# EasyEDA Pro project ProDoc_Schematic1_2025-12-02.epro

# Schematic Schematic1
Board Name: Board1; Create Date: 2025-11-19; Page Name: P1; Project Name: BezelMountPCBforSwitches; Schematic Name: Schematic1; Update Date: 2025-12-01; Company: EasyEDA.com; Page Size: A4; Version: V1.0
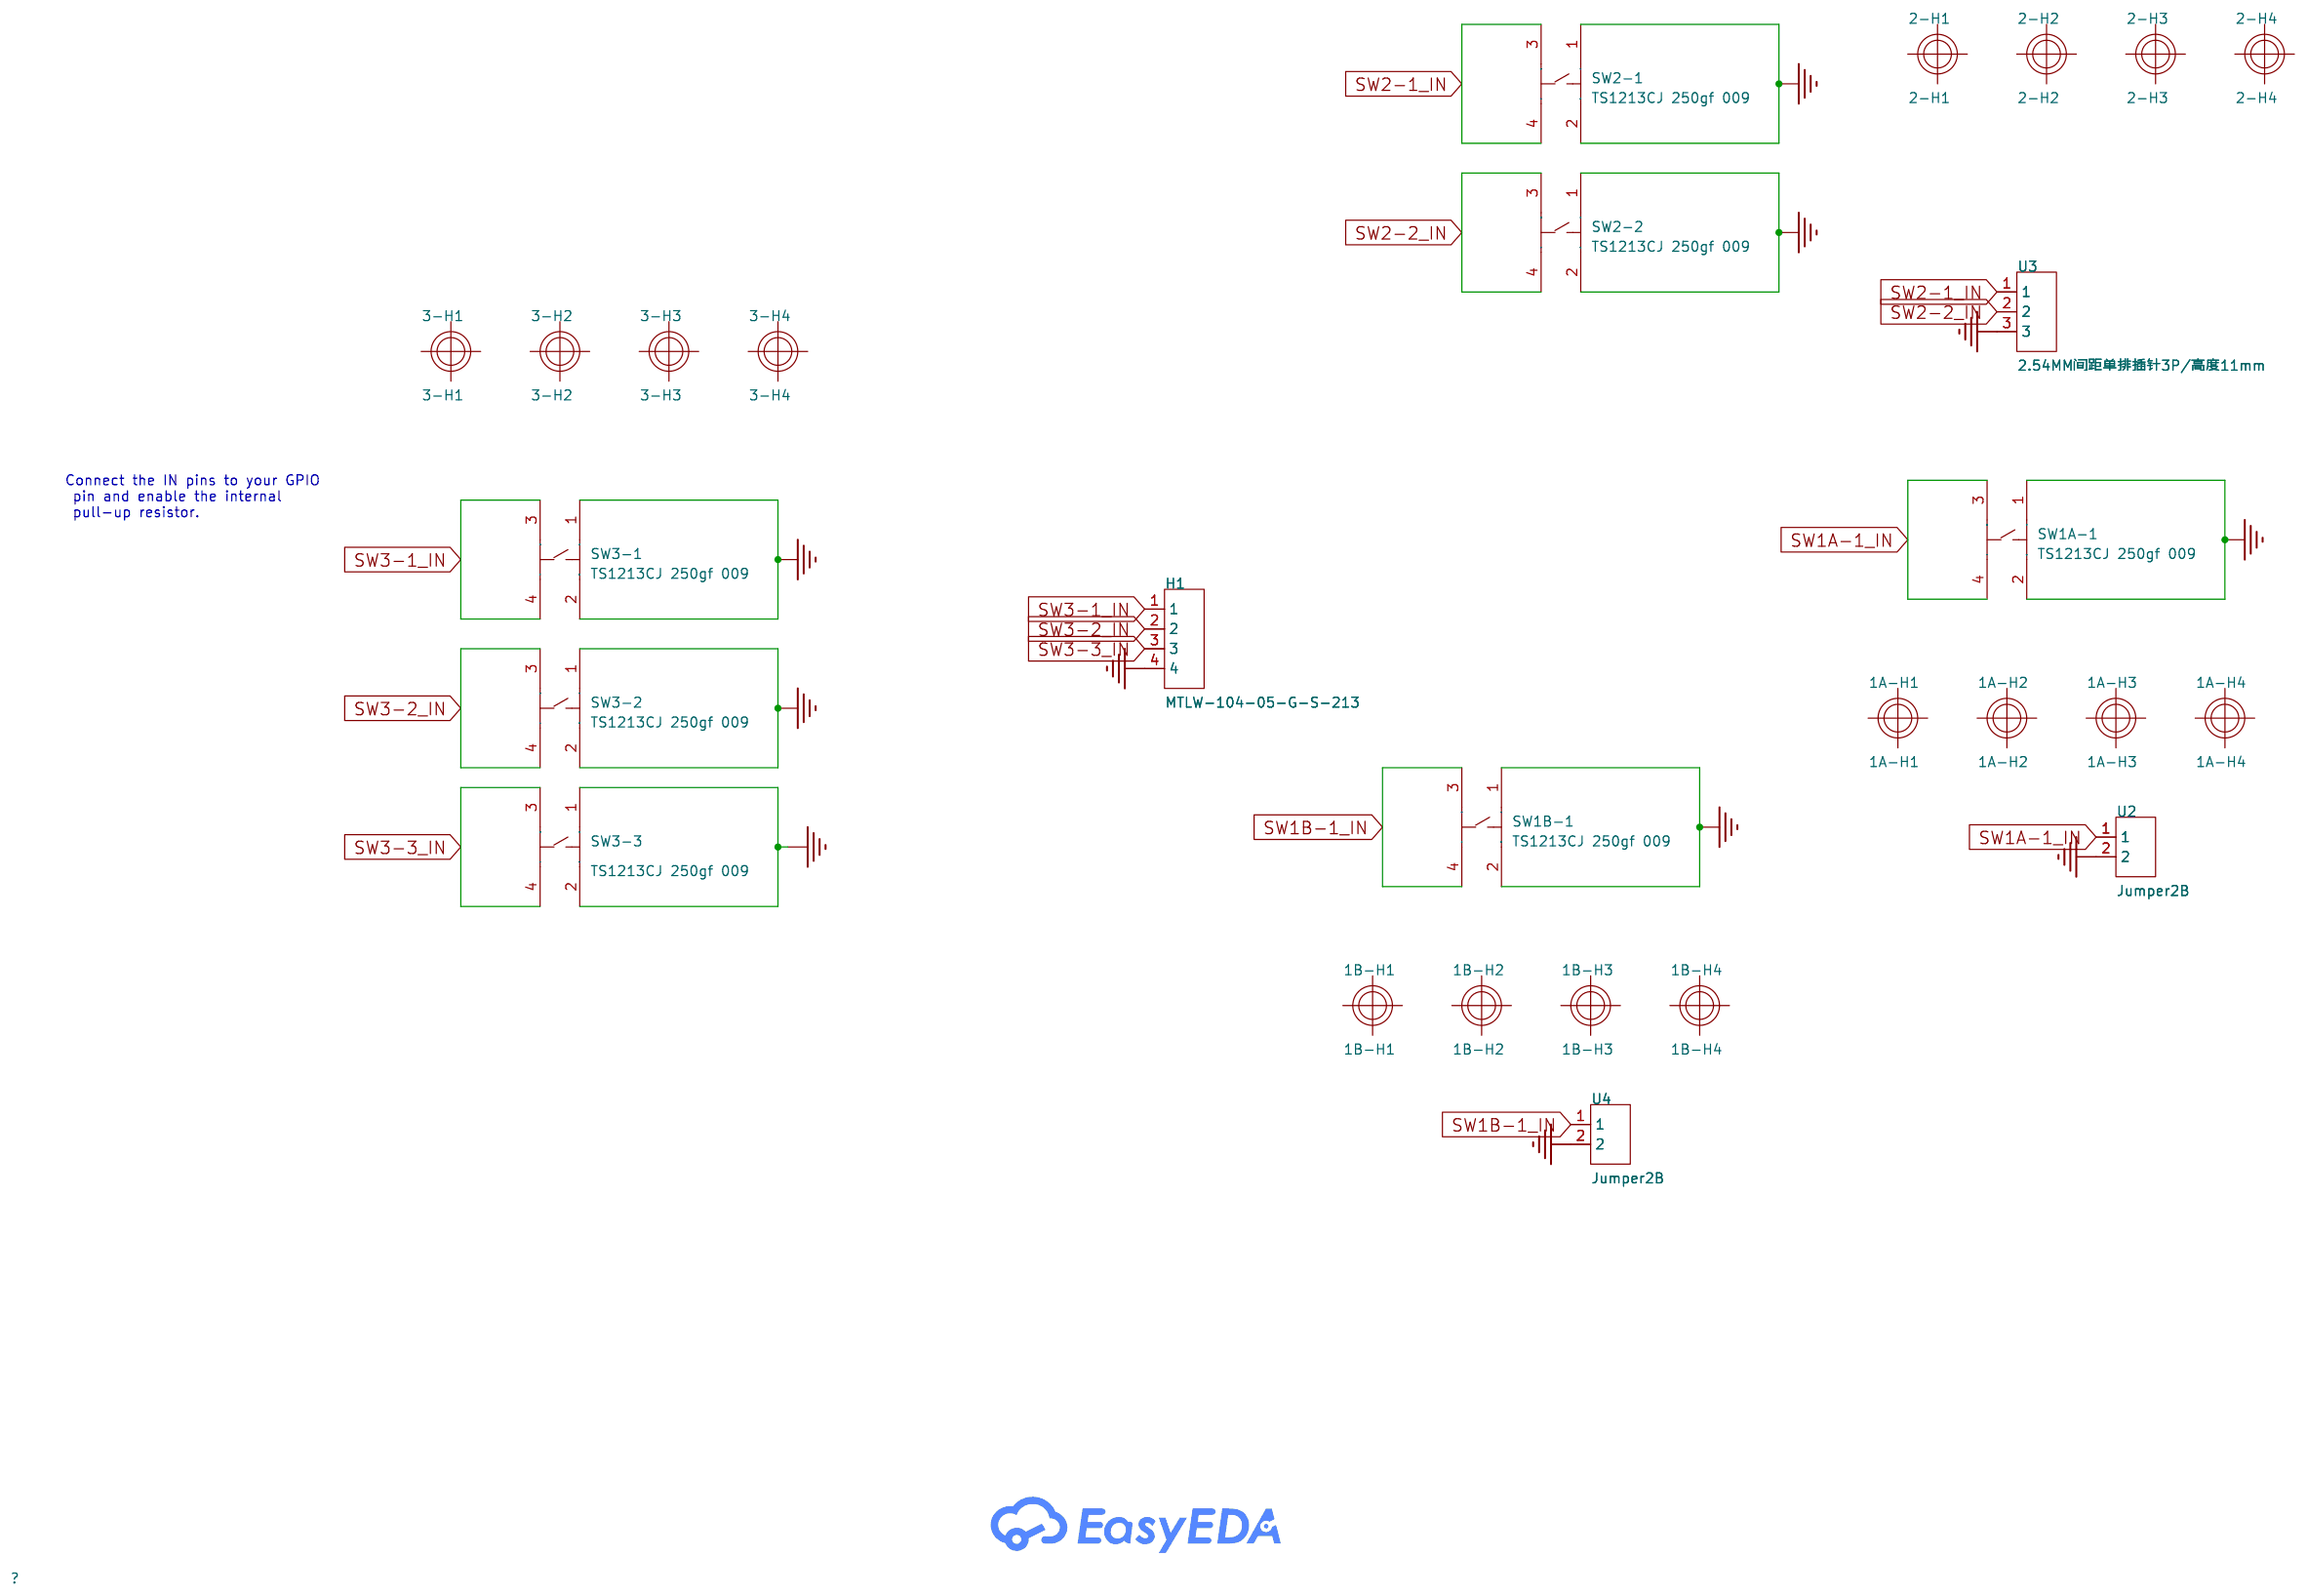
[diagram p0: schematic sheet]

## Parts
1A-H1  1A-H1  [MOUNTING_HOLE_3MM]
1A-H2  1A-H2  [MOUNTING_HOLE_3MM]
1A-H3  1A-H3  [MOUNTING_HOLE_3MM]
1A-H4  1A-H4  [MOUNTING_HOLE_3MM]
1B-H1  1B-H1  [MOUNTING_HOLE_3MM]
1B-H2  1B-H2  [MOUNTING_HOLE_3MM]
1B-H3  1B-H3  [MOUNTING_HOLE_3MM]
1B-H4  1B-H4  [MOUNTING_HOLE_3MM]
2-H1  2-H1  [MOUNTING_HOLE_3MM]
2-H2  2-H2  [MOUNTING_HOLE_3MM]
2-H3  2-H3  [MOUNTING_HOLE_3MM]
2-H4  2-H4  [MOUNTING_HOLE_3MM]
3-H1  3-H1  [MOUNTING_HOLE_3MM]
3-H2  3-H2  [MOUNTING_HOLE_3MM]
3-H3  3-H3  [MOUNTING_HOLE_3MM]
3-H4  3-H4  [MOUNTING_HOLE_3MM]
H1  MTLW-104-05-G-S-213  [HDR-TH_4P-P2.54_MTLW-104-05-G-S-165]
SW1A-1  TS1213CJ 250gf 009  [KEY-TH_4P-L12.0-W12.0-P5.00-LS12.5]
SW1B-1  TS1213CJ 250gf 009  [KEY-TH_4P-L12.0-W12.0-P5.00-LS12.5]
SW2-1  TS1213CJ 250gf 009  [KEY-TH_4P-L12.0-W12.0-P5.00-LS12.5]
SW2-2  TS1213CJ 250gf 009  [KEY-TH_4P-L12.0-W12.0-P5.00-LS12.5]
SW3-1  TS1213CJ 250gf 009  [KEY-TH_4P-L12.0-W12.0-P5.00-LS12.5]
SW3-2  TS1213CJ 250gf 009  [KEY-TH_4P-L12.0-W12.0-P5.00-LS12.5]
SW3-3  TS1213CJ 250gf 009  [KEY-TH_4P-L12.0-W12.0-P5.00-LS12.5]
U2  Jumper2B  [HDR-TH_2P-P2.54-V-M-1]
U3  2.54MM间距单排插针3P/高度11mm  [HDR-TH_3P-P2.54-V-M]
U4  Jumper2B  [HDR-TH_2P-P2.54-V-M-1]

## Library data of the parts
1A-H1-1A-H4 1B-H1-1B-H4 2-H1-2-H4 3-H1-3-H4 = mounting_hole_3mm
H1 = MTLW-104-05-G-S-213: Pitch:2.54mm Mounting Type:Through Hole Number of Rows:1 Number of Pins:4P Current Rating:5.2A Contact Material:Phosphor Bronze Contact Plating:Gold Operating Temperature:-55℃~+125℃ Operating Temperature:-55℃~+125℃ Color:Black; LCSC Part Name: 间距:2.54mm 直插; Supplier Part: C7308181; Manufacturer: SAMTEC; Supplier Footprint: 插件,P=2.54mm; JLCPCB Part Class: Extended Part; Datasheet: https://item.szlcsc.com/datasheet/MTLW-104-05-G-S-213/8278651.html; Supplier: LCSC; Pitch: 2.54mm; Mounting Type: Through Hole; Number of Rows: 1; Number of Pins: 4P; Current Rating: 5.2A; Contact Material: Phosphor Bronze; Contact Plating: Gold; Operating Temperature: -55℃~+125℃; Color: Black
SW1A-1 SW1B-1 SW2-1 SW2-2 SW3-1-SW3-3 = TS1213CJ 250gf 009: Circuit:SPST Operating Force:2.5N Mounting Type:Through Hole Length:12mm Width:12mm Switch Height:13mm with Bracket:Without Bracket Contact Current:50mA Voltage Rating:12V Life:100,000 Cycles; LCSC Part Name: 12*12*13mm 立插 轻触开关; Supplier Part: C7507422; Manufacturer: SHOU HAN(首韩); Supplier Footprint: 插件-4P,12x12mm; JLCPCB Part Class: Extended Part; Datasheet: https://item.szlcsc.com/datasheet/TS1213CJ%2520250gf%2520009/8598444.html; Supplier: LCSC; Circuit: SPST; Operating Force: 2.5N; Mounting Type: Through Hole; Length: 12mm; Width: 12mm; Switch Height: 13mm; with Bracket: Without Bracket; Contact Current: 50mA; Voltage Rating: 12V; Life: 100,000 Cycles
U2 U4 = Jumper2: Supplier Part: C2940092; Supplier Footprint: HDR-TH-2P-2.54mm; JLCPCB Part Class: Extended Part; Supplier: LCSC
U3 = 2.54MM间距单排插针3P/高度11mm: Supplier Part: C9900010938; JLCPCB Part Class: Extended Part; Supplier: LCSC

## Nets
GND1A: SW1A-1.1 SW1A-1.2 U2.2
GND1B: SW1B-1.1 SW1B-1.2 U4.2
GND2: SW2-1.1 SW2-1.2 SW2-2.1 SW2-2.2 U3.3
GND3: H1.4 SW3-1.1 SW3-1.2 SW3-2.1 SW3-2.2 SW3-3.1 SW3-3.2
SW1A-1_IN: SW1A-1.3 SW1A-1.4 U2.1
SW1B-1_IN: SW1B-1.3 SW1B-1.4 U4.1
SW2-1_IN: SW2-1.3 SW2-1.4 U3.1
SW2-2_IN: SW2-2.3 SW2-2.4 U3.2
SW3-1_IN: H1.1 SW3-1.3 SW3-1.4
SW3-2_IN: H1.2 SW3-2.3 SW3-2.4
SW3-3_IN: H1.3 SW3-3.3 SW3-3.4

## Notes on the sheet
- Connect the IN pins to your GPIO
   pin and enable the internal
   pull-up resistor.
